# EAGLE schematic Prototype_0.1 (EAGLE 9.7.0)
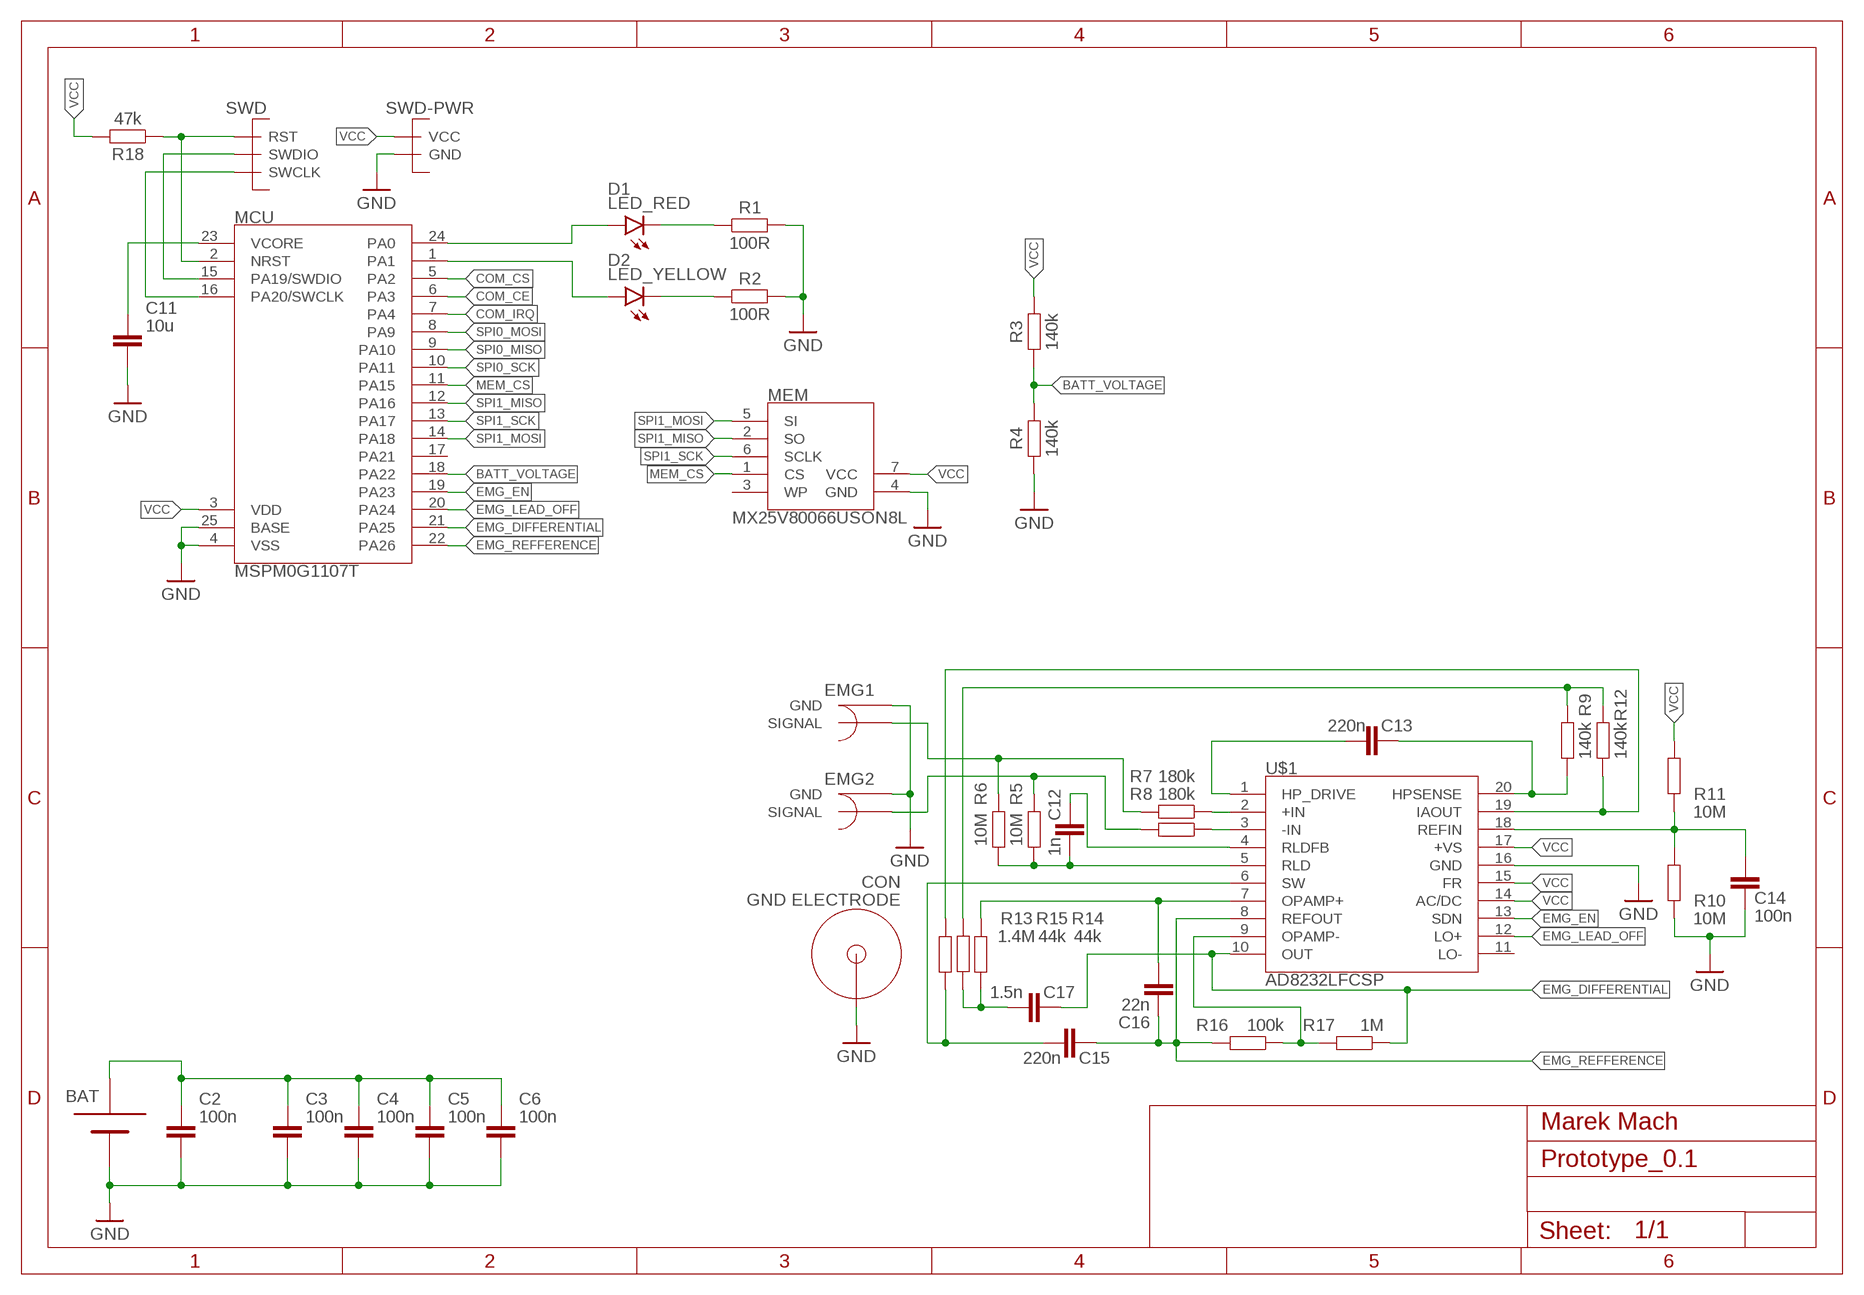
[diagram p0: schematic, sheet 1]

## Parts
BAT  2025BAT-HLD-005-THM  [BAT-HLD-005-THM]
C2  100n  C_CHIP-0603(1608-METRIC)  [CAPC1608X85]
C3  100n  C_CHIP-0603(1608-METRIC)  [CAPC1608X85]
C4  100n  C_CHIP-0603(1608-METRIC)  [CAPC1608X85]
C5  100n  C_CHIP-0603(1608-METRIC)  [CAPC1608X85]
C6  100n  C_CHIP-0603(1608-METRIC)  [CAPC1608X85]
C11  10u  C_CHIP-0603(1608-METRIC)  [CAPC1608X85]
C12  1n  C_CHIP-0603(1608-METRIC)  [CAPC1608X85]
C13  220n  C_CHIP-0603(1608-METRIC)  [CAPC1608X85]
C14  100n  C_CHIP-0603(1608-METRIC)  [CAPC1608X85]
C15  220n  C_CHIP-0603(1608-METRIC)  [CAPC1608X85]
C16  22n  C_CHIP-0603(1608-METRIC)  [CAPC1608X85]
C17  1.5n  C_CHIP-0603(1608-METRIC)  [CAPC1608X85]
CON  GND ELECTRODE  ECG_ELECTRODE_CONNECTOR  [ELECTRODE_CONNECTOR]
D1  LED_RED  CHIP-FLAT-R_0402  [LEDC1005X25N_FLAT-R]
D2  LED_YELLOW  CHIP-FLAT-Y_0402  [LEDC1005X25N_FLAT-Y]
EMG1  SHIELDED-CONNECTOR  [SHIELDED-SMD]
EMG2  SHIELDED-CONNECTOR  [SHIELDED-SMD]
MCU  MSPM0G1107T  MSPM0G1107VQFN24-ROUNDPADS  [QFN50P400X400X100-25T240]
MEM  MX25V80066USON8L  [SON50P300X200X50-8]
R1  100R  R_CHIP-0603(1608-METRIC)  [RESC1608X60]
R2  100R  R_CHIP-0603(1608-METRIC)  [RESC1608X60]
R3  140k  R_CHIP-0603(1608-METRIC)  [RESC1608X60]
R4  140k  R_CHIP-0603(1608-METRIC)  [RESC1608X60]
R5  10M  R_CHIP-0603(1608-METRIC)  [RESC1608X60]
R6  10M  R_CHIP-0603(1608-METRIC)  [RESC1608X60]
R7  180k  R_CHIP-0603(1608-METRIC)  [RESC1608X60]
R8  180k  R_CHIP-0603(1608-METRIC)  [RESC1608X60]
R9  140k  R_CHIP-0603(1608-METRIC)  [RESC1608X60]
R10  10M  R_CHIP-0603(1608-METRIC)  [RESC1608X60]
R11  10M  R_CHIP-0603(1608-METRIC)  [RESC1608X60]
R12  140k  R_CHIP-0603(1608-METRIC)  [RESC1608X60]
R13  1.4M  R_CHIP-0603(1608-METRIC)  [RESC1608X60]
R14  44k  R_CHIP-0603(1608-METRIC)  [RESC1608X60]
R15  44k  R_CHIP-0603(1608-METRIC)  [RESC1608X60]
R16  100k  R_CHIP-0603(1608-METRIC)  [RESC1608X60]
R17  1M  R_CHIP-0603(1608-METRIC)  [RESC1608X60]
R18  47k  R_CHIP-0603(1608-METRIC)  [RESC1608X60]
SWD  SWD  [3X]
SWD-PWR  PWR  [2X]
U$1  AD8232LFCSP  [QFN50P400X400X80-21T275]

## Nets
BATT_VOLTAGE [Analog]: MCU.18(PA22) R3.1 R4.2
COM_CE [Data]: MCU.6(PA3)
COM_CS [Data]: MCU.5(PA2)
COM_IRQ [Data]: MCU.7(PA4)
EMG_DIFFERENTIAL [Analog]: C17.2 MCU.21(PA25) R17.1 U$1.10(OUT)
EMG_EN [Data]: MCU.19(PA23) U$1.13(SDN)
EMG_LEAD_OFF [Data]: MCU.20(PA24) U$1.12(LO+)
EMG_REFFERENCE [Analog]: C15.2 C16.1 MCU.22(PA26) R16.2 U$1.8(REFOUT)
GND: BAT.P$1(-) C2.2 C3.2 C4.2 C5.2 C6.2 C11.2 C14.1 CON.P$1 CON.P$2 CON.P$3 CON.P$4 EMG1.GND1(GND) EMG1.GND2(GND) EMG2.GND1(GND) EMG2.GND2(GND) MCU.4(VSS) MCU.25(BASE) MEM.4(GND) R1.2 R2.2 R4.1 R10.1 SWD-PWR.1(GND) U$1.16(GND)
MEM_CS [Data]: MCU.11(PA15) MEM.1(CS)
N$2 [VCC]: C11.1 MCU.23(VCORE)
N$3: D1.C R1.1
N$4: D2.C R2.1
N$8 [Data]: D1.A MCU.24(PA0)
N$9 [Data]: D2.A MCU.1(PA1)
N$10 [Analog]: EMG1.SIG(SIGNAL) R6.2 R7.2
N$11 [Analog]: EMG2.SIG(SIGNAL) R5.2 R8.2
N$12 [Analog]: R7.1 U$1.2(+IN)
N$13 [Analog]: R8.1 U$1.3(-IN)
N$14 [Analog]: C16.2 R14.1 U$1.7(OPAMP+)
N$16 [Analog]: R16.1 R17.2 U$1.9(OPAMP-)
N$17 [Analog]: R9.2 R12.2 R15.2
N$18 [Analog]: C12.1 R5.1 R6.1 U$1.5(RLD)
N$19 [Analog]: C13.1 U$1.1(HP_DRIVE)
N$20 [Analog]: C13.2 R9.1 U$1.20(HPSENSE)
N$22 [Analog]: C14.2 R10.2 R11.1 U$1.18(REFIN)
N$24 [Analog]: C15.1 R13.2 U$1.6(SW)
N$25: C17.1 R14.2 R15.1
N$26 [Analog]: R12.1 R13.1 U$1.19(IAOUT)
N$27 [Analog]: C12.2 U$1.4(RLDFB)
RST [Data]: MCU.2(NRST) R18.1 SWD.1(RST)
SPI0_MISO [Data]: MCU.9(PA10)
SPI0_MOSI [Data]: MCU.8(PA9)
SPI0_SCK [Data]: MCU.10(PA11)
SPI1_MISO [Data]: MCU.12(PA16) MEM.2(SO)
SPI1_MOSI [Data]: MCU.14(PA18) MEM.5(SI)
SPI1_SCK [Data]: MCU.13(PA17) MEM.6(SCLK)
SWCLK [Data]: MCU.16(PA20/SWCLK) SWD.3(SWCLK)
SWDIO [Data]: MCU.15(PA19/SWDIO) SWD.2(SWDIO)
VCC [VCC]: BAT.P$2(+) BAT.P$3(+) C2.1 C3.1 C4.1 C5.1 C6.1 MCU.3(VDD) MEM.7(VCC) R3.2 R11.2 R18.2 SWD-PWR.2(VCC) U$1.14(AC/DC) U$1.15(FR) U$1.17(+VS)
Unconnected: MCU.17(PA21) MEM.3(WP) U$1.11(LO-)

## Notes on the sheet
- Marek Mach

## Library data of the parts
BAT = batery holder:2025: Coin Cell Battery Holders THM COIN CELL CLIP FOR (2) 2032 Source: Datasheet <https://www.keyelco.com/product-pdf.cfm?p=740>
C2-C6 C11-C17 = Capacitor:C: Capacitor - Generic; CATEGORY: Capacitor; PACKAGE_SIZE: 0603; PACKAGE_TYPE: SMD; SUBCATEGORY: Ceramic Capacitors; TYPE: MLCC
CON = Ecg Electrodes:ECG_ELECTRODE_CONNECTOR
D1 = LED:CHIP-FLAT-R; CATEGORY: LED; COLOR: RED; DESCRIPTION: CHIP LED FLAT; SUB-CATEGORY: CHIP; TYPE: FLAT_TOP
D2 = LED:CHIP-FLAT-Y; CATEGORY: LED; COLOR: YELLOW; DESCRIPTION: CHIP LED FLAT; SUB-CATEGORY: CHIP; TYPE: FLAT_TOP
EMG1 EMG2 = Ecg Electrodes:SHIELDED-CONNECTOR
MCU = Texas Instruments:MSPM0G1107
MEM = MemoryChips:MX25V80066
R1-R18 = Resistor:R: Resistor Fixed - Generic; CATEGORY: Resistors; DESCRIPTION: Chip Resistor 1.60 X 0.82 X 0.60 mm body 0603(1608-METRIC) Package; PACKAGE_SIZE: 0603; PACKAGE_TYPE: SMD
SWD = DebugConnectors§:SWD
SWD-PWR = DebugConnectors§:PWR
U$1 = Ecg Electrodes:AD8232